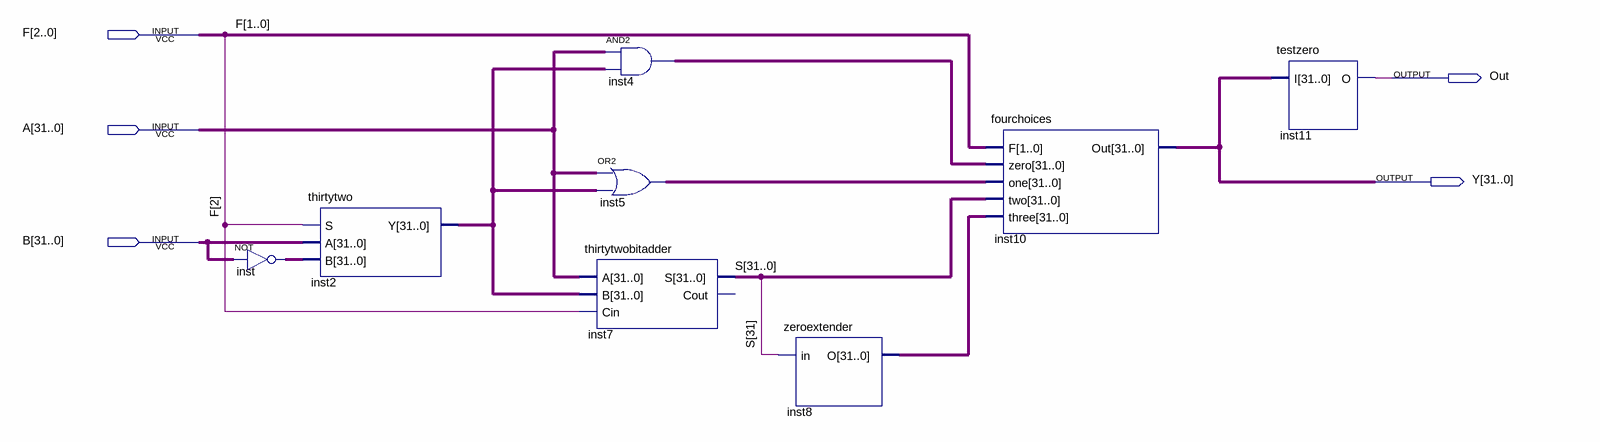
[diagram p0: schematic sheet]
// Quartus schematic alu.bdf as structural Verilog: 8 symbols, 5 pins
module alu (
  input  [2:0] F,
  input  [31:0] A,
  input  [31:0] B,
  output Out,
  output [31:0] Y
);

  wire [31:0] inst2_y, inst4_out, inst5_out, inst8_o, inst_out, S;

  assign inst_out = ~B;  // NOT inst, 32 bits wide
  thirtytwo inst2 (.S(F[2]), .A(B), .B(inst_out), .Y(inst2_y));
  assign inst5_out = A | inst2_y;  // OR2 inst5, 32 bits wide
  thirtytwobitadder inst7 (.A(A), .B(inst2_y), .Cin(F[2]), .S(S));  // open: Cout
  assign inst4_out = A & inst2_y;  // AND2 inst4, 32 bits wide
  zeroextender inst8 (.in(S[31]), .O(inst8_o));
  fourchoices inst10 (.F(F[1:0]), .zero(inst4_out), .one(inst5_out), .two(S), .three(inst8_o), .Out(Y));
  testzero inst11 (.I(Y), .O(Out));
endmodule
